# EAGLE schematic probings (EAGLE 6.0)
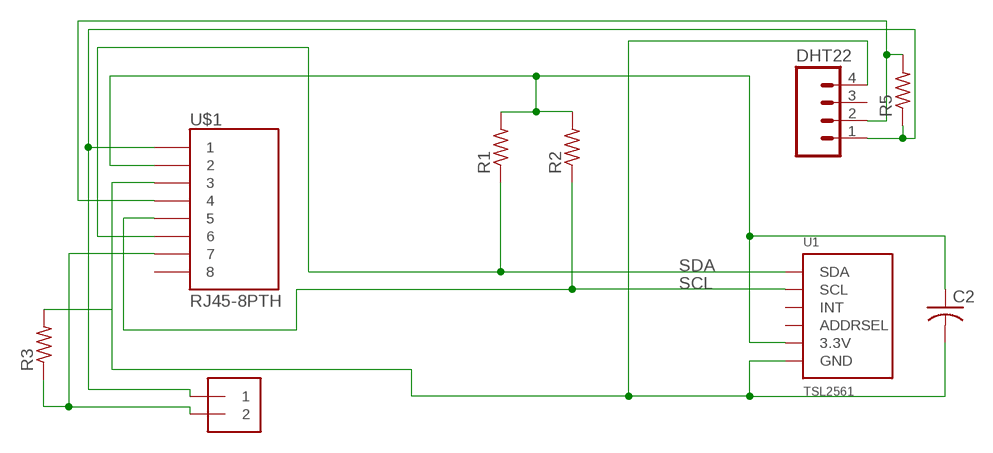
[diagram p0: schematic, sheet 1]

## Parts
C2  C-US025-024X044  [C025-024X044]
DHT22  M04PTH  [1X04]
J1  1X2-3.5MM  [1X2-3.5MM]
R1  R-US_0204/7  [0204/7]
R2  R-US_0204/7  [0204/7]
R3  R-US_0204/7  [0204/7]
R5  R-US_0204/7  [0204/7]
U1  TSL2561  [TSL2561_FN]
U$1  RJ45-8PTH  [RJ45-8]

## Nets
N$1: C2.1 R1.2 R2.2 U1.VDD(3.3V) U$1.2
N$2: C2.2 DHT22.4 R3.2 U1.VSS(GND) U$1.3
N$3: DHT22.1 J1.1 R5.1 U$1.1
N$4: DHT22.2 R5.2 U$1.4
N$5: J1.2 R3.1 U$1.7
SCL: R2.1 U1.CLK(SCL) U$1.5
SDA: R1.1 U1.DATA(SDA) U$1.6
Unconnected: DHT22.3 U1.ADR(ADDRSEL) U1.INT U$1.8

## Library data of the parts
C2 = adafruit:C-US: CAPACITOR, American symbol
DHT22 = SparkFun-Connectors:M04: Header 4 Standard 4-pin 0.1" header. Use with straight break away headers (SKU : PRT-00116), right angle break away headers (PRT-00553), swiss pins (PRT-00743), machine pins (PRT-00117), and female headers (PRT-00115). Molex polarized connector foot print use with SKU : PRT-08231 with associated crimp pins and housings. 1MM SMD Version SKU: PRT-10208
J1 = adafruit:1X2: 3.5mm Terminal block http://www.ladyada.net/library/pcb/eaglelibrary.html
R1-R3 R5 = adafruit:R-US_: RESISTOR, American symbol
U1 = microbuilder:TSL2561: TSL2561 Light-To-Digital Sensor Mouser Part Numbers: CS (obsolete): 856-TSL2561CS DFN (cheapest): 856-TSL2561FN
U$1 = SparkFun:RJ45-8: RJ45 Jack Simple RJ45, 8-pin connection - connector for common Cat5, Cat5e, and Cat6 Ethernet cables. Footprint not yet proven in production. Connector sku is PRT-00643; Breakout PCB sku is BOB-00716.